# EAGLE schematic Register Board 2.1 (EAGLE 6.5.0)

## Sheet 1 of 3
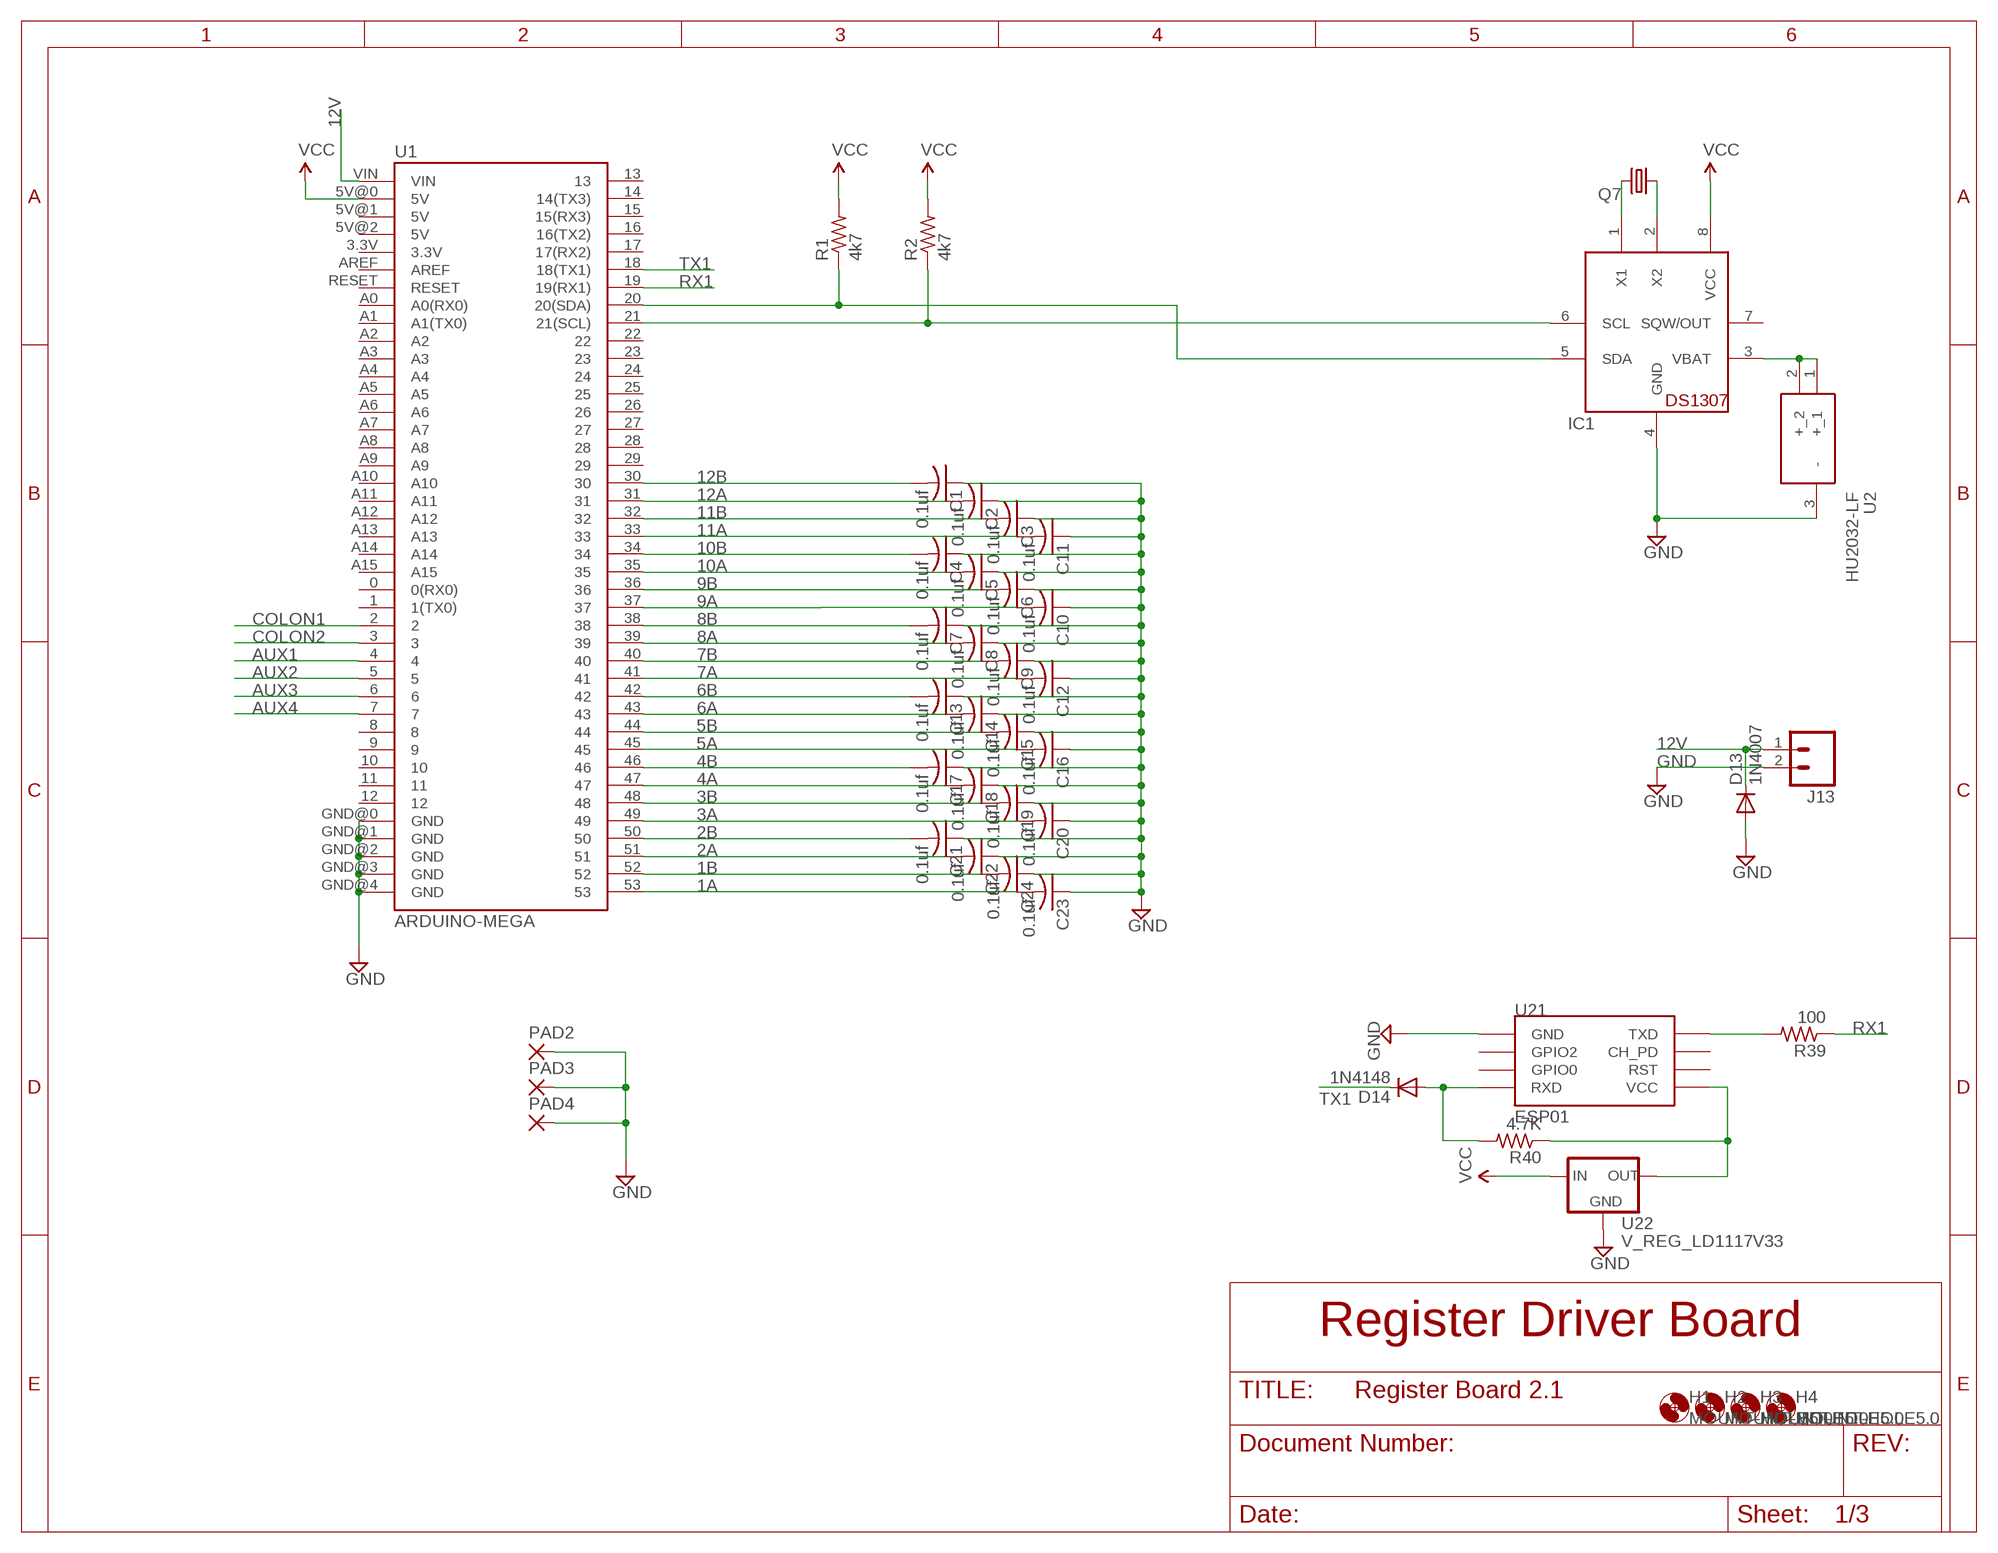
[diagram p0: schematic, sheet 1]

### Parts
C1  0.1uf  C-US025-025X050  [C025-025X050]
C2  0.1uf  C-US025-025X050  [C025-025X050]
C3  0.1uf  C-US025-025X050  [C025-025X050]
C4  0.1uf  C-US025-025X050  [C025-025X050]
C5  0.1uf  C-US025-025X050  [C025-025X050]
C6  0.1uf  C-US025-025X050  [C025-025X050]
C7  0.1uf  C-US025-025X050  [C025-025X050]
C8  0.1uf  C-US025-025X050  [C025-025X050]
C9  0.1uf  C-US025-025X050  [C025-025X050]
C10  0.1uf  C-US025-025X050  [C025-025X050]
C11  0.1uf  C-US025-025X050  [C025-025X050]
C12  0.1uf  C-US025-025X050  [C025-025X050]
C13  0.1uf  C-US025-025X050  [C025-025X050]
C14  0.1uf  C-US025-025X050  [C025-025X050]
C15  0.1uf  C-US025-025X050  [C025-025X050]
C16  0.1uf  C-US025-025X050  [C025-025X050]
C17  0.1uf  C-US025-025X050  [C025-025X050]
C18  0.1uf  C-US025-025X050  [C025-025X050]
C19  0.1uf  C-US025-025X050  [C025-025X050]
C20  0.1uf  C-US025-025X050  [C025-025X050]
C21  0.1uf  C-US025-025X050  [C025-025X050]
C22  0.1uf  C-US025-025X050  [C025-025X050]
C23  0.1uf  C-US025-025X050  [C025-025X050]
C24  0.1uf  C-US025-025X050  [C025-025X050]
D13  1N4007  1N4004  [DO41-10]
D14  1N4148  [DO35-10]
H1  MOUNT-HOLE5.0  [5,0]
H2  MOUNT-HOLE5.0  [5,0]
H3  MOUNT-HOLE5.0  [5,0]
H4  MOUNT-HOLE5.0  [5,0]
IC1  DS1307  [DIL08]
J13  M025MM  [SCREWTERMINAL-5MM-2]
PAD2  1,6/0,8  [1,6/0,8]
PAD3  1,6/0,8  [1,6/0,8]
PAD4  1,6/0,8  [1,6/0,8]
Q7  CRYSTALTC26H  [TC26H]
R1  4k7  R-US_0204/7  [0204/7]
R2  4k7  R-US_0204/7  [0204/7]
R39  100  R-US_0204/7  [0204/7]
R40  4.7K  R-US_0204/7  [0204/7]
U1  ARDUINO-MEGA  [ARDUINO_MEGA_PINSONLY]
U2  HU2032-LF  [HU2032LF]
U21  ESP01  [ESP01]
U22  V_REG_LD1117V33  V_REG_LD1117VXX  [78XXL]

### Nets
1A: C23.2 U1.53 ; also sheet 2
1B: C24.2 U1.52 ; also sheet 3
2A: C22.2 U1.51 ; also sheet 2
2B: C21.2 U1.50 ; also sheet 3
3A: C20.2 U1.49 ; also sheet 2
3B: C19.2 U1.48 ; also sheet 3
4A: C18.2 U1.47 ; also sheet 2
4B: C17.2 U1.46 ; also sheet 3
5A: C16.2 U1.45 ; also sheet 2
5B: C15.2 U1.44 ; also sheet 3
6A: C14.2 U1.43 ; also sheet 2
6B: C13.2 U1.42 ; also sheet 3
7A: C12.2 U1.41 ; also sheet 2
7B: C9.2 U1.40 ; also sheet 3
8A: C8.2 U1.39 ; also sheet 2
8B: C7.2 U1.38 ; also sheet 3
9A: U1.37 ; also sheet 2
9B: C6.2 U1.36 ; also sheet 3
10A: C5.2 U1.35 ; also sheet 2
10B: C4.2 U1.34 ; also sheet 3
11A: C11.2 U1.33 ; also sheet 2
11B: C3.2 U1.32 ; also sheet 3
12A: C2.2 U1.31 ; also sheet 2
12B: C1.2 U1.30 ; also sheet 3
12V [PWR]: D13.C J13.1 U1.VIN ; also sheet 3
AUX1: U1.4 ; also sheet 2
AUX2: U1.5 ; also sheet 2
AUX3: U1.6 ; also sheet 2
AUX4: U1.7 ; also sheet 2
COLON1: U1.2 ; also sheet 2
COLON2: U1.3 ; also sheet 2
GND [PWR]: C1.1 C2.1 C3.1 C4.1 C5.1 C6.1 C7.1 C8.1 C9.1 C10.1 C11.1 C12.1 C13.1 C14.1 C15.1 C16.1 C17.1 C18.1 C19.1 C20.1 C21.1 C22.1 C23.1 C24.1 D13.A IC1.4(GND) J13.2 PAD2.1(P) PAD3.1(P) PAD4.1(P) U1.GND@0(GND) U1.GND@1(GND) U1.GND@2(GND) U1.GND@3(GND) U1.GND@4(GND) U2.3(-) U21.GND U22.IN(GND) ; also sheet 2,3
N$1: IC1.5(SDA) R1.1 U1.20(20(SDA))
N$2: IC1.6(SCL) R2.1 U1.21(21(SCL))
N$3: IC1.2(X2) Q7.1
N$4: IC1.1(X1) Q7.2
N$5: IC1.3(VBAT) U2.1(+_1) U2.2(+_2)
N$12: R39.2 U21.TX(TXD)
N$13: C10.2
N$14: R40.1 U21.VCC U22.GND(OUT)
N$15: D14.A R40.2 U21.RX(RXD)
RX1: R39.1 U1.19(19(RX1))
TX1: D14.C U1.18(18(TX1))
VCC [PWR]: IC1.8(VCC) R1.2 R2.2 U1.5V@0(5V) U22.OUT(IN)
Unconnected: IC1.7(SQW/OUT) U1.0(0(RX0)) U1.1(1(TX0)) U1.3.3V U1.5V@1(5V) U1.5V@2(5V) U1.8 U1.9 U1.10 U1.11 U1.12 U1.13 U1.14(14(TX3)) U1.15(15(RX3)) U1.16(16(TX2)) U1.17(17(RX2)) U1.22 U1.23 U1.24 U1.25 U1.26 U1.27 U1.28 U1.29 U1.A0(A0(RX0)) U1.A1(A1(TX0)) U1.A2 U1.A3 U1.A4 U1.A5 U1.A6 U1.A7 U1.A8 U1.A9 U1.A10 U1.A11 U1.A12 U1.A13 U1.A14 U1.A15 U1.AREF U1.RESET U21.CH_PD U21.GPIO0 U21.GPIO2 U21.RST

### Notes on the sheet
- Register Driver Board

## Sheet 2 of 3
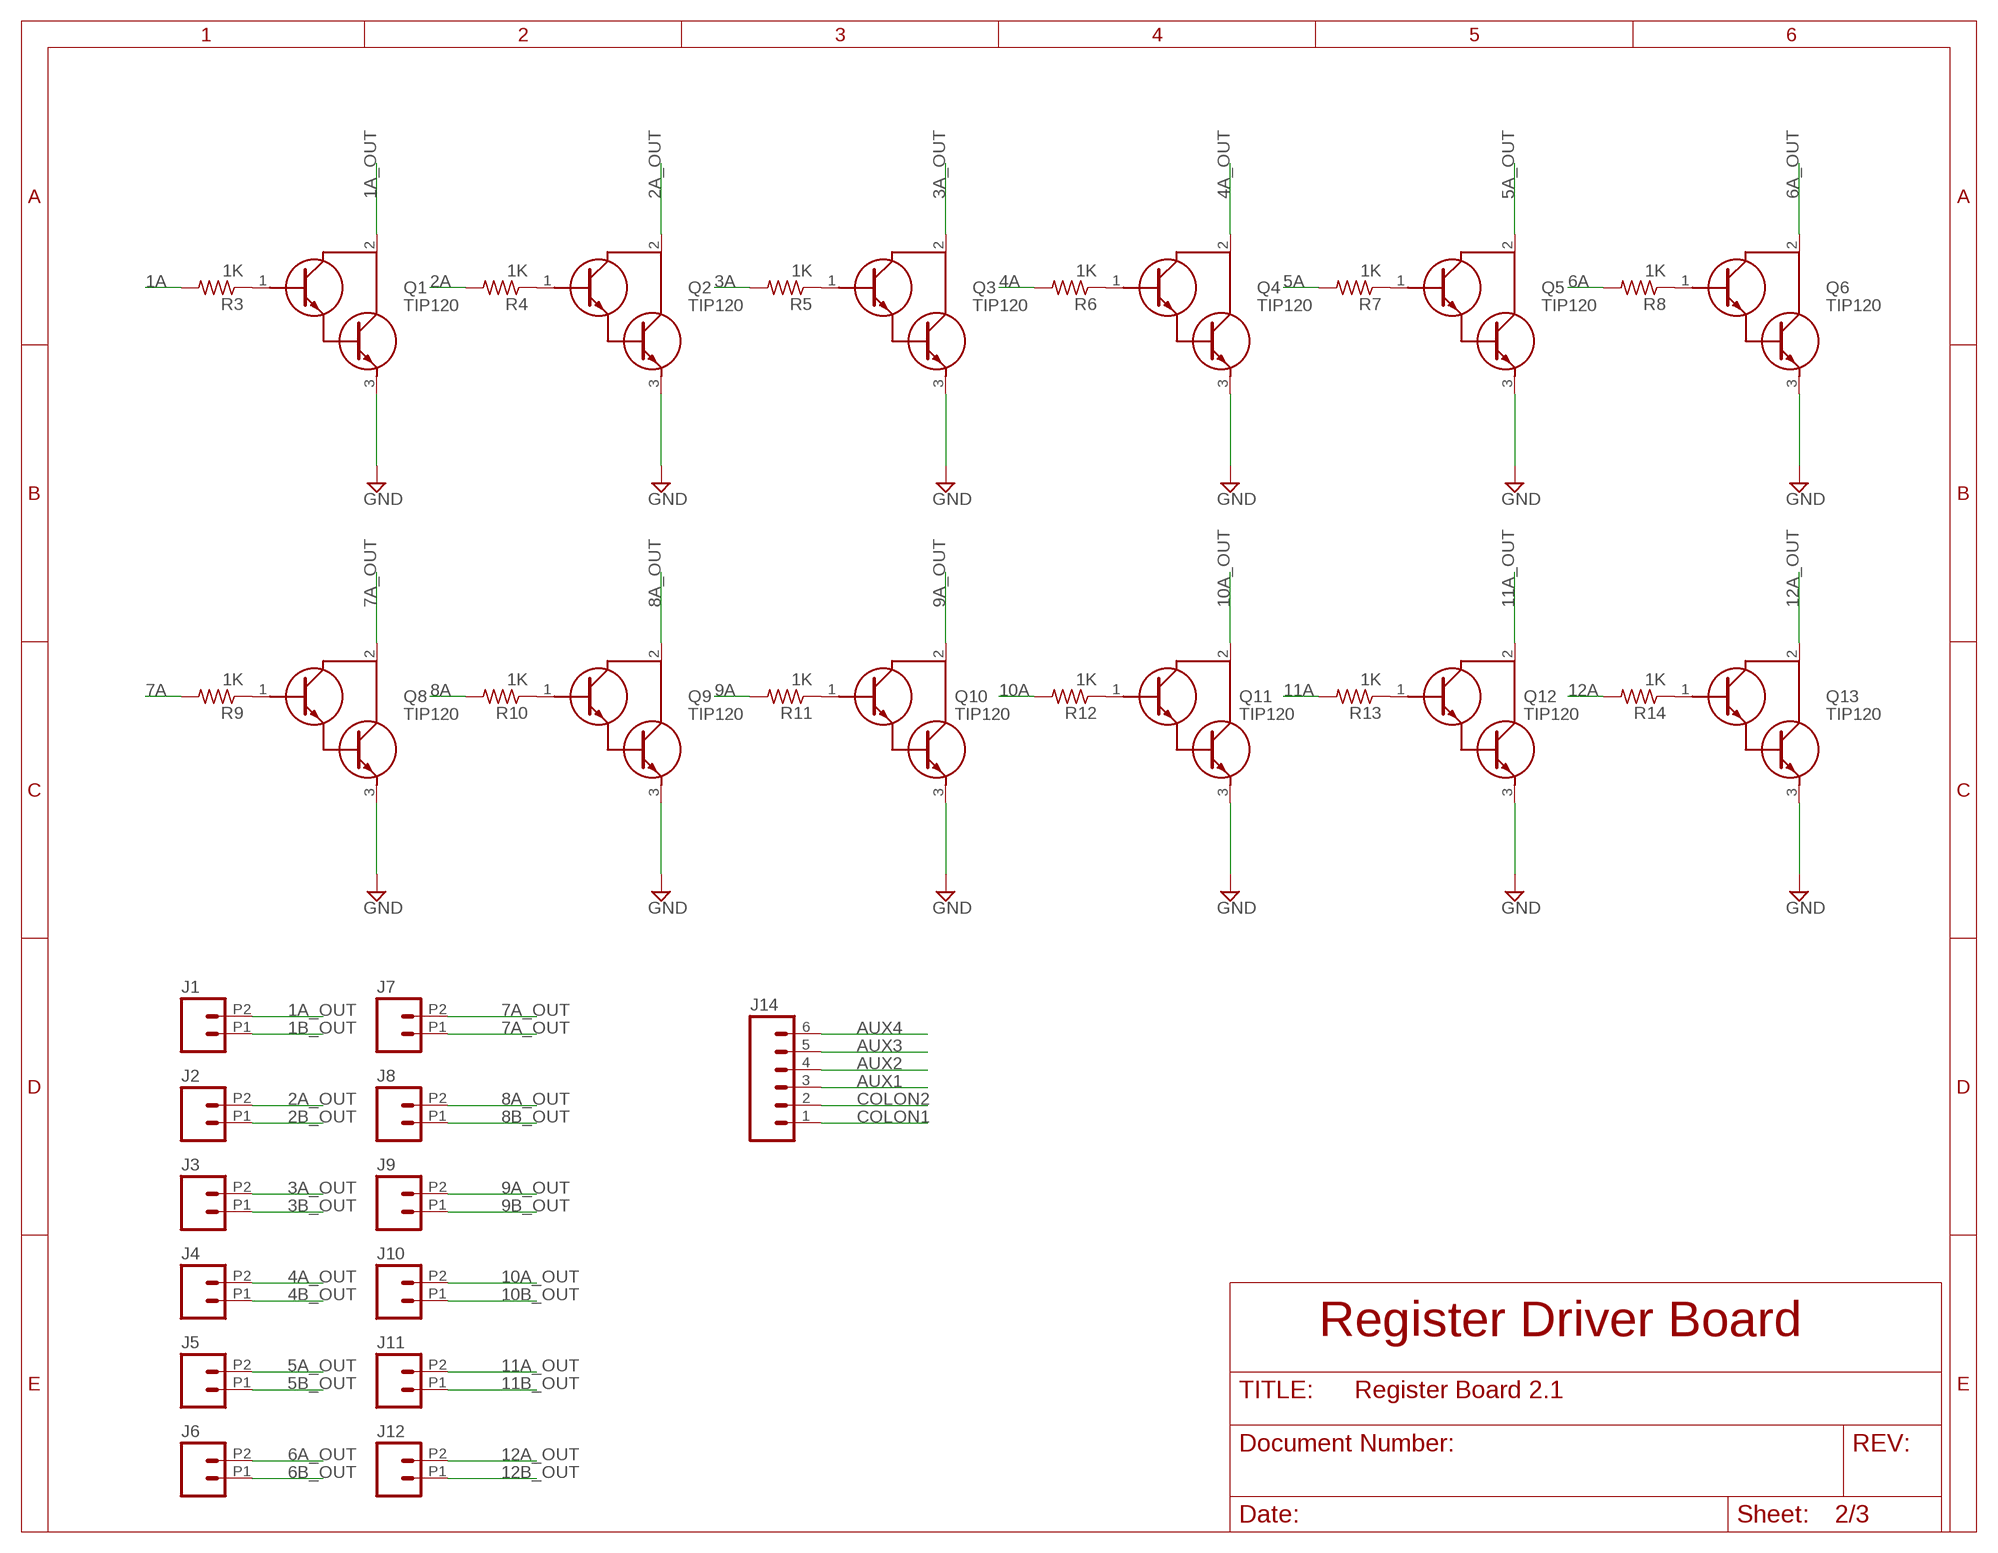
[diagram p1: schematic, sheet 2]

### Parts
J1  M022.54MM_SCREWTERM  [1X02_2.54_SCREWTERM]
J2  M022.54MM_SCREWTERM  [1X02_2.54_SCREWTERM]
J3  M022.54MM_SCREWTERM  [1X02_2.54_SCREWTERM]
J4  M022.54MM_SCREWTERM  [1X02_2.54_SCREWTERM]
J5  M022.54MM_SCREWTERM  [1X02_2.54_SCREWTERM]
J6  M022.54MM_SCREWTERM  [1X02_2.54_SCREWTERM]
J7  M022.54MM_SCREWTERM  [1X02_2.54_SCREWTERM]
J8  M022.54MM_SCREWTERM  [1X02_2.54_SCREWTERM]
J9  M022.54MM_SCREWTERM  [1X02_2.54_SCREWTERM]
J10  M022.54MM_SCREWTERM  [1X02_2.54_SCREWTERM]
J11  M022.54MM_SCREWTERM  [1X02_2.54_SCREWTERM]
J12  M022.54MM_SCREWTERM  [1X02_2.54_SCREWTERM]
J14  M06LOCK  [1X06_LOCK]
Q1  TIP120  [TO255P460X1020X2008-3P]
Q2  TIP120  [TO255P460X1020X2008-3P]
Q3  TIP120  [TO255P460X1020X2008-3P]
Q4  TIP120  [TO255P460X1020X2008-3P]
Q5  TIP120  [TO255P460X1020X2008-3P]
Q6  TIP120  [TO255P460X1020X2008-3P]
Q8  TIP120  [TO255P460X1020X2008-3P]
Q9  TIP120  [TO255P460X1020X2008-3P]
Q10  TIP120  [TO255P460X1020X2008-3P]
Q11  TIP120  [TO255P460X1020X2008-3P]
Q12  TIP120  [TO255P460X1020X2008-3P]
Q13  TIP120  [TO255P460X1020X2008-3P]
R3  1K  R-US_0204/7  [0204/7]
R4  1K  R-US_0204/7  [0204/7]
R5  1K  R-US_0204/7  [0204/7]
R6  1K  R-US_0204/7  [0204/7]
R7  1K  R-US_0204/7  [0204/7]
R8  1K  R-US_0204/7  [0204/7]
R9  1K  R-US_0204/7  [0204/7]
R10  1K  R-US_0204/7  [0204/7]
R11  1K  R-US_0204/7  [0204/7]
R12  1K  R-US_0204/7  [0204/7]
R13  1K  R-US_0204/7  [0204/7]
R14  1K  R-US_0204/7  [0204/7]

### Nets
1A: R3.2 ; also sheet 1
1A_OUT [PWR]: J1.P2 Q1.2(C)
1B_OUT [PWR]: J1.P1 ; also sheet 3
2A: R4.2 ; also sheet 1
2A_OUT [PWR]: J2.P2 Q2.2(C)
2B_OUT [PWR]: J2.P1 ; also sheet 3
3A: R5.2 ; also sheet 1
3A_OUT [PWR]: J3.P2 Q3.2(C)
3B_OUT [PWR]: J3.P1 ; also sheet 3
4A: R6.2 ; also sheet 1
4A_OUT [PWR]: J4.P2 Q4.2(C)
4B_OUT [PWR]: J4.P1 ; also sheet 3
5A: R7.2 ; also sheet 1
5A_OUT [PWR]: J5.P2 Q5.2(C)
5B_OUT [PWR]: J5.P1 ; also sheet 3
6A: R8.2 ; also sheet 1
6A_OUT [PWR]: J6.P2 Q6.2(C)
6B_OUT [PWR]: J6.P1 ; also sheet 3
7A: R9.2 ; also sheet 1
7A_OUT [PWR]: J7.P1 J7.P2 Q8.2(C)
8A: R10.2 ; also sheet 1
8A_OUT [PWR]: J8.P2 Q9.2(C)
8B_OUT [PWR]: J8.P1 ; also sheet 3
9A: R11.2 ; also sheet 1
9A_OUT [PWR]: J9.P2 Q10.2(C)
9B_OUT [PWR]: J9.P1 ; also sheet 3
10A: R12.2 ; also sheet 1
10A_OUT [PWR]: J10.P2 Q11.2(C)
10B_OUT [PWR]: J10.P1 ; also sheet 3
11A: R13.2 ; also sheet 1
11A_OUT [PWR]: J11.P2 Q12.2(C)
11B_OUT [PWR]: J11.P1 ; also sheet 3
12A: R14.2 ; also sheet 1
12A_OUT [PWR]: J12.P2 Q13.2(C)
12B_OUT: J12.P1
AUX1: J14.3 ; also sheet 1
AUX2: J14.4 ; also sheet 1
AUX3: J14.5 ; also sheet 1
AUX4: J14.6 ; also sheet 1
COLON1: J14.1 ; also sheet 1
COLON2: J14.2 ; also sheet 1
GND [PWR]: Q1.3(E) Q2.3(E) Q3.3(E) Q4.3(E) Q5.3(E) Q6.3(E) Q8.3(E) Q9.3(E) Q10.3(E) Q11.3(E) Q12.3(E) Q13.3(E) ; also sheet 1,3
N$6: Q1.1(B) R3.1
N$7: Q2.1(B) R4.1
N$8: Q3.1(B) R5.1
N$9: Q4.1(B) R6.1
N$10: Q5.1(B) R7.1
N$11: Q6.1(B) R8.1
N$24: Q8.1(B) R9.1
N$25: Q9.1(B) R10.1
N$26: Q10.1(B) R11.1
N$27: Q11.1(B) R12.1
N$28: Q12.1(B) R13.1
N$29: Q13.1(B) R14.1

### Notes on the sheet
- Register Driver Board

## Sheet 3 of 3
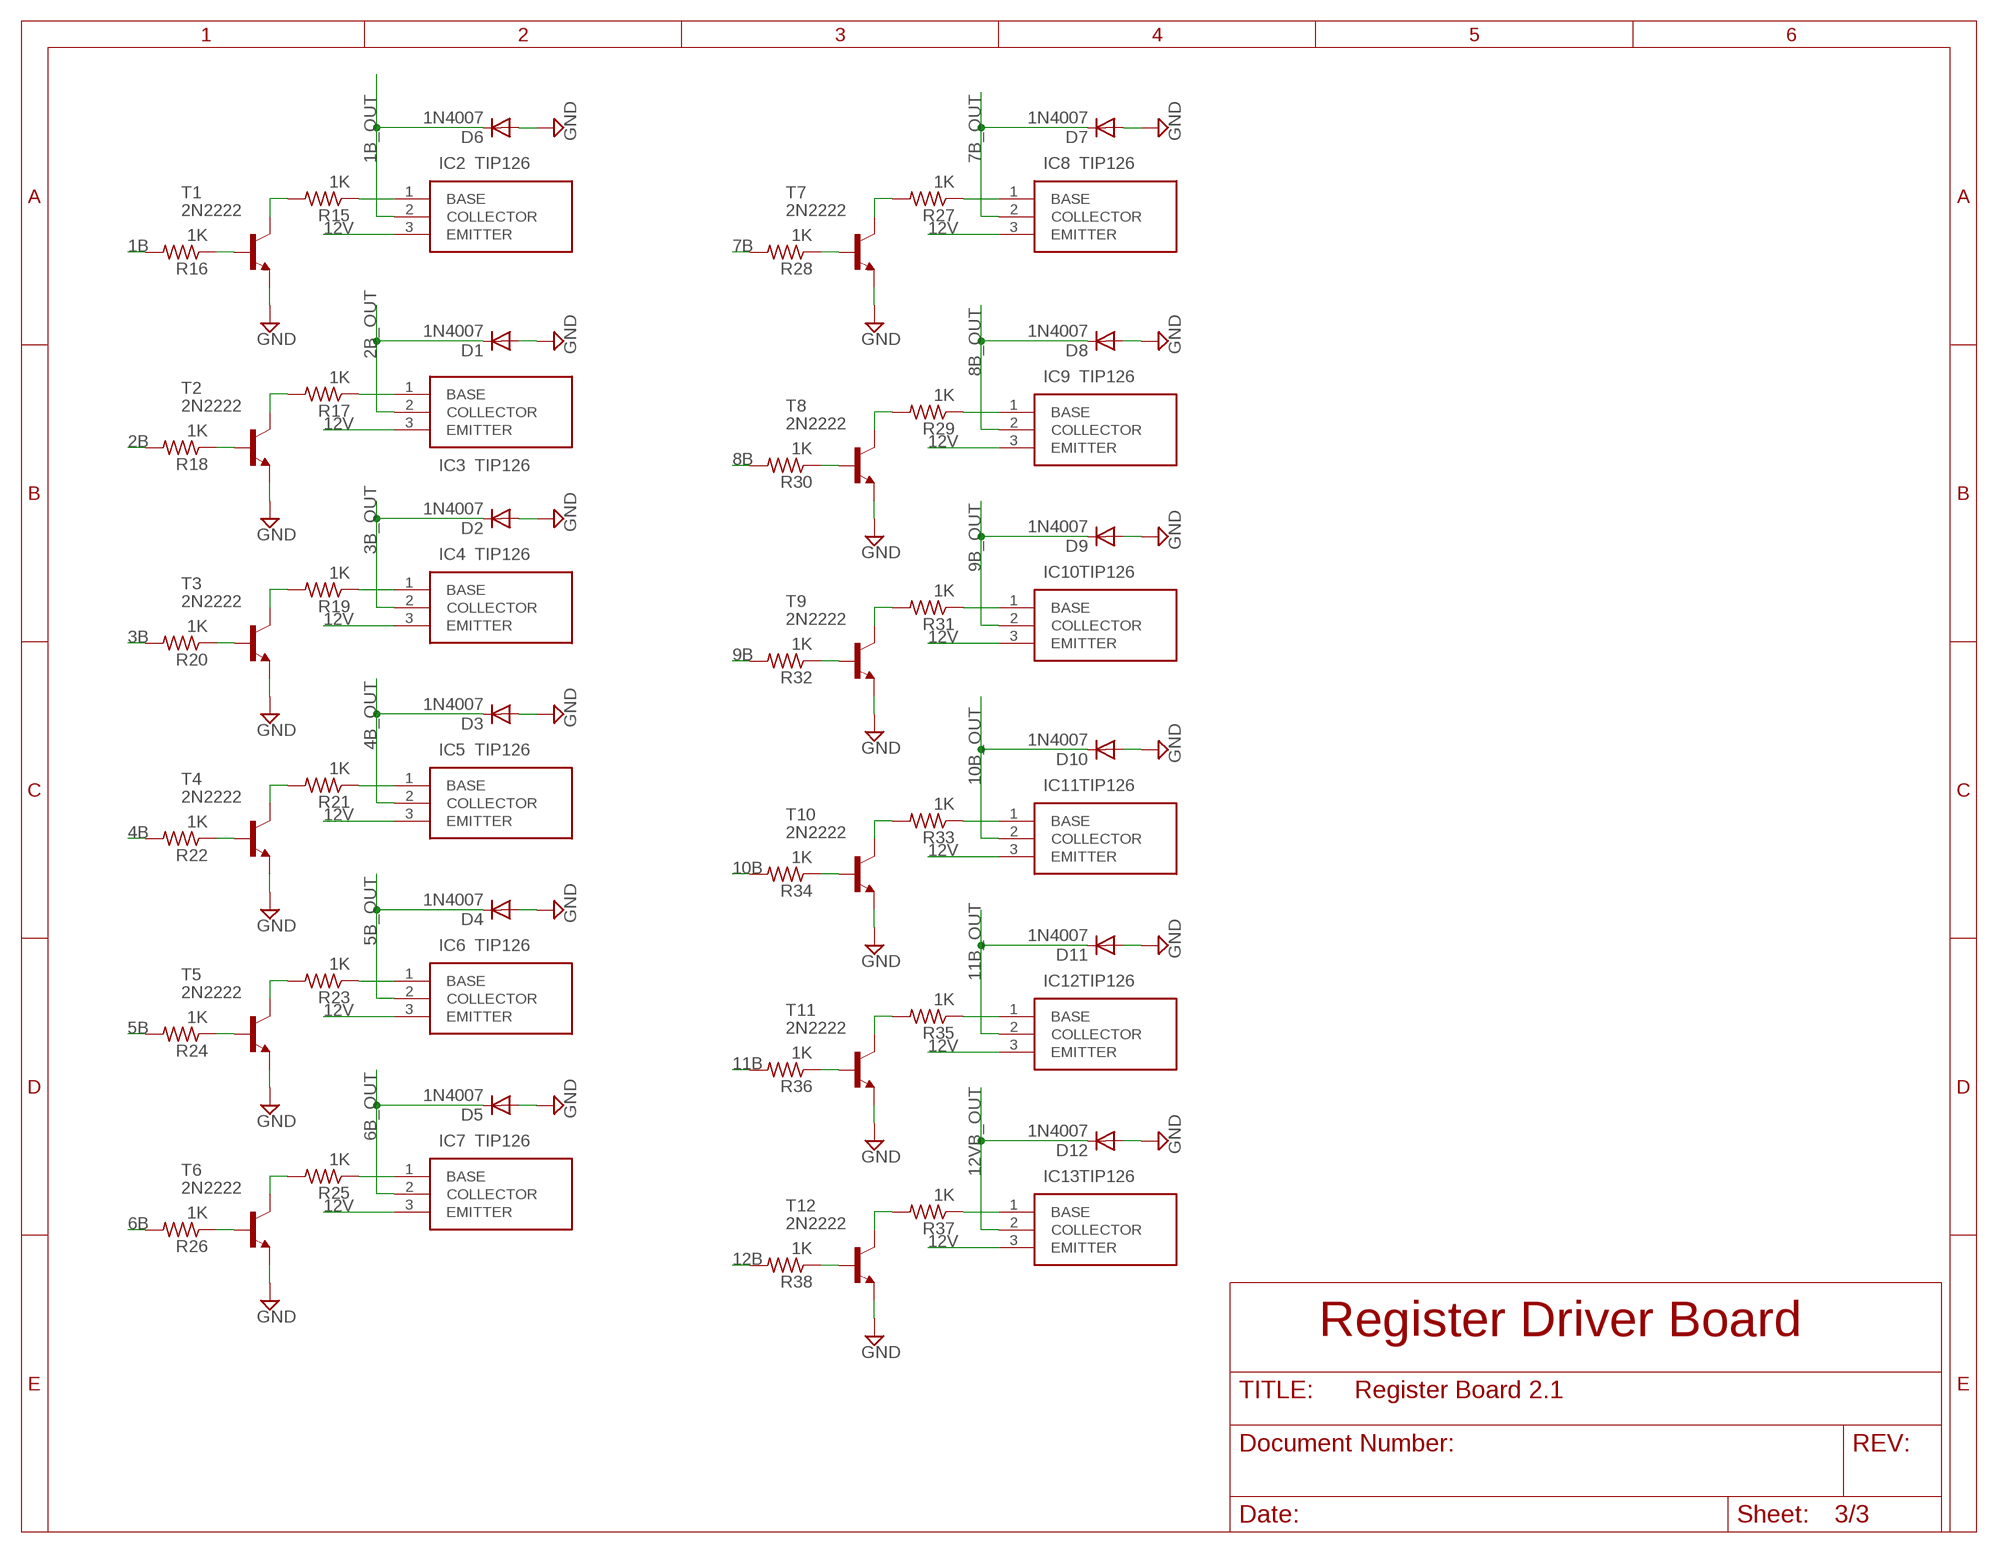
[diagram p2: schematic, sheet 3]

### Parts
D1  1N4007  1N4004  [DO41-10]
D2  1N4007  1N4004  [DO41-10]
D3  1N4007  1N4004  [DO41-10]
D4  1N4007  1N4004  [DO41-10]
D5  1N4007  1N4004  [DO41-10]
D6  1N4007  1N4004  [DO41-10]
D7  1N4007  1N4004  [DO41-10]
D8  1N4007  1N4004  [DO41-10]
D9  1N4007  1N4004  [DO41-10]
D10  1N4007  1N4004  [DO41-10]
D11  1N4007  1N4004  [DO41-10]
D12  1N4007  1N4004  [DO41-10]
IC2  TIP126  [TO304P498X1010X2089-3P]
IC3  TIP126  [TO304P498X1010X2089-3P]
IC4  TIP126  [TO304P498X1010X2089-3P]
IC5  TIP126  [TO304P498X1010X2089-3P]
IC6  TIP126  [TO304P498X1010X2089-3P]
IC7  TIP126  [TO304P498X1010X2089-3P]
IC8  TIP126  [TO304P498X1010X2089-3P]
IC9  TIP126  [TO304P498X1010X2089-3P]
IC10  TIP126  [TO304P498X1010X2089-3P]
IC11  TIP126  [TO304P498X1010X2089-3P]
IC12  TIP126  [TO304P498X1010X2089-3P]
IC13  TIP126  [TO304P498X1010X2089-3P]
R15  1K  R-US_0204/7  [0204/7]
R16  1K  R-US_0204/7  [0204/7]
R17  1K  R-US_0204/7  [0204/7]
R18  1K  R-US_0204/7  [0204/7]
R19  1K  R-US_0204/7  [0204/7]
R20  1K  R-US_0204/7  [0204/7]
R21  1K  R-US_0204/7  [0204/7]
R22  1K  R-US_0204/7  [0204/7]
R23  1K  R-US_0204/7  [0204/7]
R24  1K  R-US_0204/7  [0204/7]
R25  1K  R-US_0204/7  [0204/7]
R26  1K  R-US_0204/7  [0204/7]
R27  1K  R-US_0204/7  [0204/7]
R28  1K  R-US_0204/7  [0204/7]
R29  1K  R-US_0204/7  [0204/7]
R30  1K  R-US_0204/7  [0204/7]
R31  1K  R-US_0204/7  [0204/7]
R32  1K  R-US_0204/7  [0204/7]
R33  1K  R-US_0204/7  [0204/7]
R34  1K  R-US_0204/7  [0204/7]
R35  1K  R-US_0204/7  [0204/7]
R36  1K  R-US_0204/7  [0204/7]
R37  1K  R-US_0204/7  [0204/7]
R38  1K  R-US_0204/7  [0204/7]
T1  2N2222  [TO92-EBC-OVAL]
T2  2N2222  [TO92-EBC-OVAL]
T3  2N2222  [TO92-EBC-OVAL]
T4  2N2222  [TO92-EBC-OVAL]
T5  2N2222  [TO92-EBC-OVAL]
T6  2N2222  [TO92-EBC-OVAL]
T7  2N2222  [TO92-EBC-OVAL]
T8  2N2222  [TO92-EBC-OVAL]
T9  2N2222  [TO92-EBC-OVAL]
T10  2N2222  [TO92-EBC-OVAL]
T11  2N2222  [TO92-EBC-OVAL]
T12  2N2222  [TO92-EBC-OVAL]

### Nets
1B: R16.2 ; also sheet 1
1B_OUT [PWR]: D6.C IC2.2(COLLECTOR) ; also sheet 2
2B: R18.2 ; also sheet 1
2B_OUT [PWR]: D1.C IC3.2(COLLECTOR) ; also sheet 2
3B: R20.2 ; also sheet 1
3B_OUT [PWR]: D2.C IC4.2(COLLECTOR) ; also sheet 2
4B: R22.2 ; also sheet 1
4B_OUT [PWR]: D3.C IC5.2(COLLECTOR) ; also sheet 2
5B: R24.2 ; also sheet 1
5B_OUT [PWR]: D4.C IC6.2(COLLECTOR) ; also sheet 2
6B: R26.2 ; also sheet 1
6B_OUT [PWR]: D5.C IC7.2(COLLECTOR) ; also sheet 2
7B: R28.2 ; also sheet 1
7B_OUT [PWR]: D7.C IC8.2(COLLECTOR)
8B: R30.2 ; also sheet 1
8B_OUT [PWR]: D8.C IC9.2(COLLECTOR) ; also sheet 2
9B: R32.2 ; also sheet 1
9B_OUT [PWR]: D9.C IC10.2(COLLECTOR) ; also sheet 2
10B: R34.2 ; also sheet 1
10B_OUT [PWR]: D10.C IC11.2(COLLECTOR) ; also sheet 2
11B: R36.2 ; also sheet 1
11B_OUT [PWR]: D11.C IC12.2(COLLECTOR) ; also sheet 2
12B: R38.2 ; also sheet 1
12V [PWR]: IC2.3(EMITTER) IC3.3(EMITTER) IC4.3(EMITTER) IC5.3(EMITTER) IC6.3(EMITTER) IC7.3(EMITTER) IC8.3(EMITTER) IC9.3(EMITTER) IC10.3(EMITTER) IC11.3(EMITTER) IC12.3(EMITTER) IC13.3(EMITTER) ; also sheet 1
12VB_OUT [PWR]: D12.C IC13.2(COLLECTOR)
GND [PWR]: D1.A D2.A D3.A D4.A D5.A D6.A D7.A D8.A D9.A D10.A D11.A D12.A T1.E T2.E T3.E T4.E T5.E T6.E T7.E T8.E T9.E T10.E T11.E T12.E ; also sheet 1,2
N$17: IC2.1(BASE) R15.1
N$19: R15.2 T1.C
N$20: R16.1 T1.B
N$21: IC3.1(BASE) R17.1
N$35: R17.2 T2.C
N$36: R18.1 T2.B
N$37: IC4.1(BASE) R19.1
N$39: R19.2 T3.C
N$40: R20.1 T3.B
N$42: IC5.1(BASE) R21.1
N$44: R21.2 T4.C
N$45: R22.1 T4.B
N$46: IC6.1(BASE) R23.1
N$48: R23.2 T5.C
N$49: R24.1 T5.B
N$50: IC7.1(BASE) R25.1
N$52: R25.2 T6.C
N$53: R26.1 T6.B
N$54: IC8.1(BASE) R27.1
N$56: R27.2 T7.C
N$57: R28.1 T7.B
N$58: IC9.1(BASE) R29.1
N$60: R29.2 T8.C
N$61: R30.1 T8.B
N$62: IC10.1(BASE) R31.1
N$64: R31.2 T9.C
N$65: R32.1 T9.B
N$66: IC11.1(BASE) R33.1
N$68: R33.2 T10.C
N$69: R34.1 T10.B
N$70: IC12.1(BASE) R35.1
N$72: R35.2 T11.C
N$73: R36.1 T11.B
N$74: IC13.1(BASE) R37.1
N$76: R37.2 T12.C
N$77: R38.1 T12.B

### Notes on the sheet
- Register Driver Board

## Library data of the parts
C1-C24 = adafruit:C-US: CAPACITOR, American symbol
D1-D13 = diode:1N4004: DIODE general purpose rectifier, 1 A
D14 = diode:1N4148: DIODE high speed (Philips)
H1-H4 = holes:MOUNT-HOLE: MOUNTING HOLE with drill center marker
IC1 = adafruit:DS1307: DS1307 Real time clock (RTC) with battery backup ability. Talk to it via i2c
IC2-IC13 = SamacSys_Parts:TIP126: MULTICOMP - TIP126 - DARLINGTON TRANSISTOR, TO-220 Source: Datasheet <https://componentsearchengine.com/Datasheets/2/TIP126.pdf>; ARROW_PART_NUMBER: TIP126; ARROW_PRICE-STOCK: https://www.arrow.com/en/products/tip126/on-semiconductor?region=europe; DESCRIPTION: MULTICOMP - TIP126 - DARLINGTON TRANSISTOR, TO-220; HEIGHT: 4.98mm; MANUFACTURER_NAME: onsemi; MANUFACTURER_PART_NUMBER: TIP126; MOUSER_PART_NUMBER: 512-TIP126; MOUSER_PRICE-STOCK: https://www.mouser.co.uk/ProductDetail/ON-Semiconductor-Fairchild/TIP126?qs=f8e5tgPJFBNCy6oH1UbX%2Fg%3D%3D
J1-J12 = SparkFun-Connectors:M02: Standard 2-pin 0.1" header. Use with - straight break away headers ( PRT-00116) - right angle break away headers (PRT-00553) - swiss pins (PRT-00743) - machine pins (PRT-00117) - female headers (PRT-00115) Molex polarized connector foot print use with: PRT-08233 with associated crimp pins and housings. 2.54_SCREWTERM for use with PRT-10571. 3.5mm Screw Terminal footprints for PRT-08084 5mm Screw Terminal footprints for use with PRT-08432
J13 = SparkFun-Connectors:M02: Standard 2-pin 0.1" header. Use with - straight break away headers ( PRT-00116) - right angle break away headers (PRT-00553) - swiss pins (PRT-00743) - machine pins (PRT-00117) - female headers (PRT-00115) Molex polarized connector foot print use with: PRT-08233 with associated crimp pins and housings. 2.54_SCREWTERM for use with PRT-10571. 3.5mm Screw Terminal footprints for PRT-08084 5mm Screw Terminal footprints for use with PRT-08432; STOREFRONT_ID: PRT-08432
J14 = SparkFun-Connectors:M06: Header 6 Standard 6-pin 0.1" header. Use with straight break away headers (SKU : PRT-00116), right angle break away headers (PRT-00553), swiss pins (PRT-00743), machine pins (PRT-00117), and female headers (PRT-00115). Molex polarized connector foot print use with SKU : PRT-08094 with associated crimp pins and housings. NOTES ON THE VARIANTS LOCK and LOCK_LONGPADS... This footprint was designed to help hold the alignment of a through-hole component (i.e. 6-pin header) while soldering it into place. You may notice that each hole has been shifted either up or down by 0.005 of an inch from it's more standard position (which is a perfectly straight line). This slight alteration caused the pins (the squares in the middle) to touch the edges of the holes. Because they are alternating, it causes a "brace" to hold the component in place. 0.005 has proven to be the perfect amount of "off-center" position when using our standard breakaway headers. Although looks a little odd when you look at the bare footprint, once you have a header in there, the alteration is very hard to notice. Also,if you push a header all the way into place, it is covered up entirely on the bottom side. This idea of altering the position of holes to aid alignment will be further integrated into the Sparkfun Library for other footprints. It can help hold any component with 3 or more connection pins.
PAD2-PAD4 = wirepad:1,6/0,8: THROUGH-HOLE PAD
Q1-Q6 Q8-Q13 = SamacSys_Parts:TIP120: NPN darlington transistor,TIP120 5A Source: Datasheet <https://www.st.com/resource/en/datasheet/cd00000911.pdf>; ARROW_PART_NUMBER: TIP120; ARROW_PRICE-STOCK: https://www.arrow.com/en/products/tip120/stmicroelectronics?region=europe; DESCRIPTION: NPN darlington transistor,TIP120 5A; HEIGHT: 4.6mm; MANUFACTURER_NAME: STMicroelectronics; MANUFACTURER_PART_NUMBER: TIP120; MOUSER_PART_NUMBER: 511-TIP120; MOUSER_PRICE-STOCK: https://www.mouser.co.uk/ProductDetail/STMicroelectronics/TIP120?qs=ljbEvF4DwOPl3O93r6IAPg%3D%3D
Q7 = adafruit:CRYSTAL: CRYSTAL; OC_FARNELL: unknown; OC_NEWARK: unknown
R1-R40 = rcl:R-US_: RESISTOR, American symbol
T1-T12 = adafruit:2N2222: NPN TRANSISTOR Big oval pads
U1 = _DENNIS:ARDUINO-MEGA: Arduino Mega board footprint
U2 = SamacSys_Parts:HU2032-LF: RENATA - HU2032-LF - HOLDER, BATTERY, THT, CR2032 Source: Datasheet <https://componentsearchengine.com/Datasheets/2/HU2032-LF.pdf>; DESCRIPTION: RENATA - HU2032-LF - HOLDER, BATTERY, THT, CR2032; HEIGHT: mm; MANUFACTURER_NAME: RENATA; MANUFACTURER_PART_NUMBER: HU2032-LF; MOUSER_PART_NUMBER: 614-HU2032-LF; MOUSER_PRICE-STOCK: https://www.mouser.co.uk/ProductDetail/Renata/HU2032-LF?qs=oUsD4qhOtFwA99zRPu3JIQ%3D%3D
U21 = esp8266modules:ESP01: ESP8266 Wifi module 01
U22 = SparkFun-PowerIC:V_REG_LD1117VXX: LD1117VXX voltage regulator. We carry the 3.3V version (COM-00526) in TO-220 package.

## Net classes
0 default: width 0.305 mm, clearance 0.254 mm
1 PWR: width 0.762 mm, clearance 0.254 mm